# EAGLE design Radial-V Ext (EAGLE 7.4.0)
Extension Board for Radial-V.
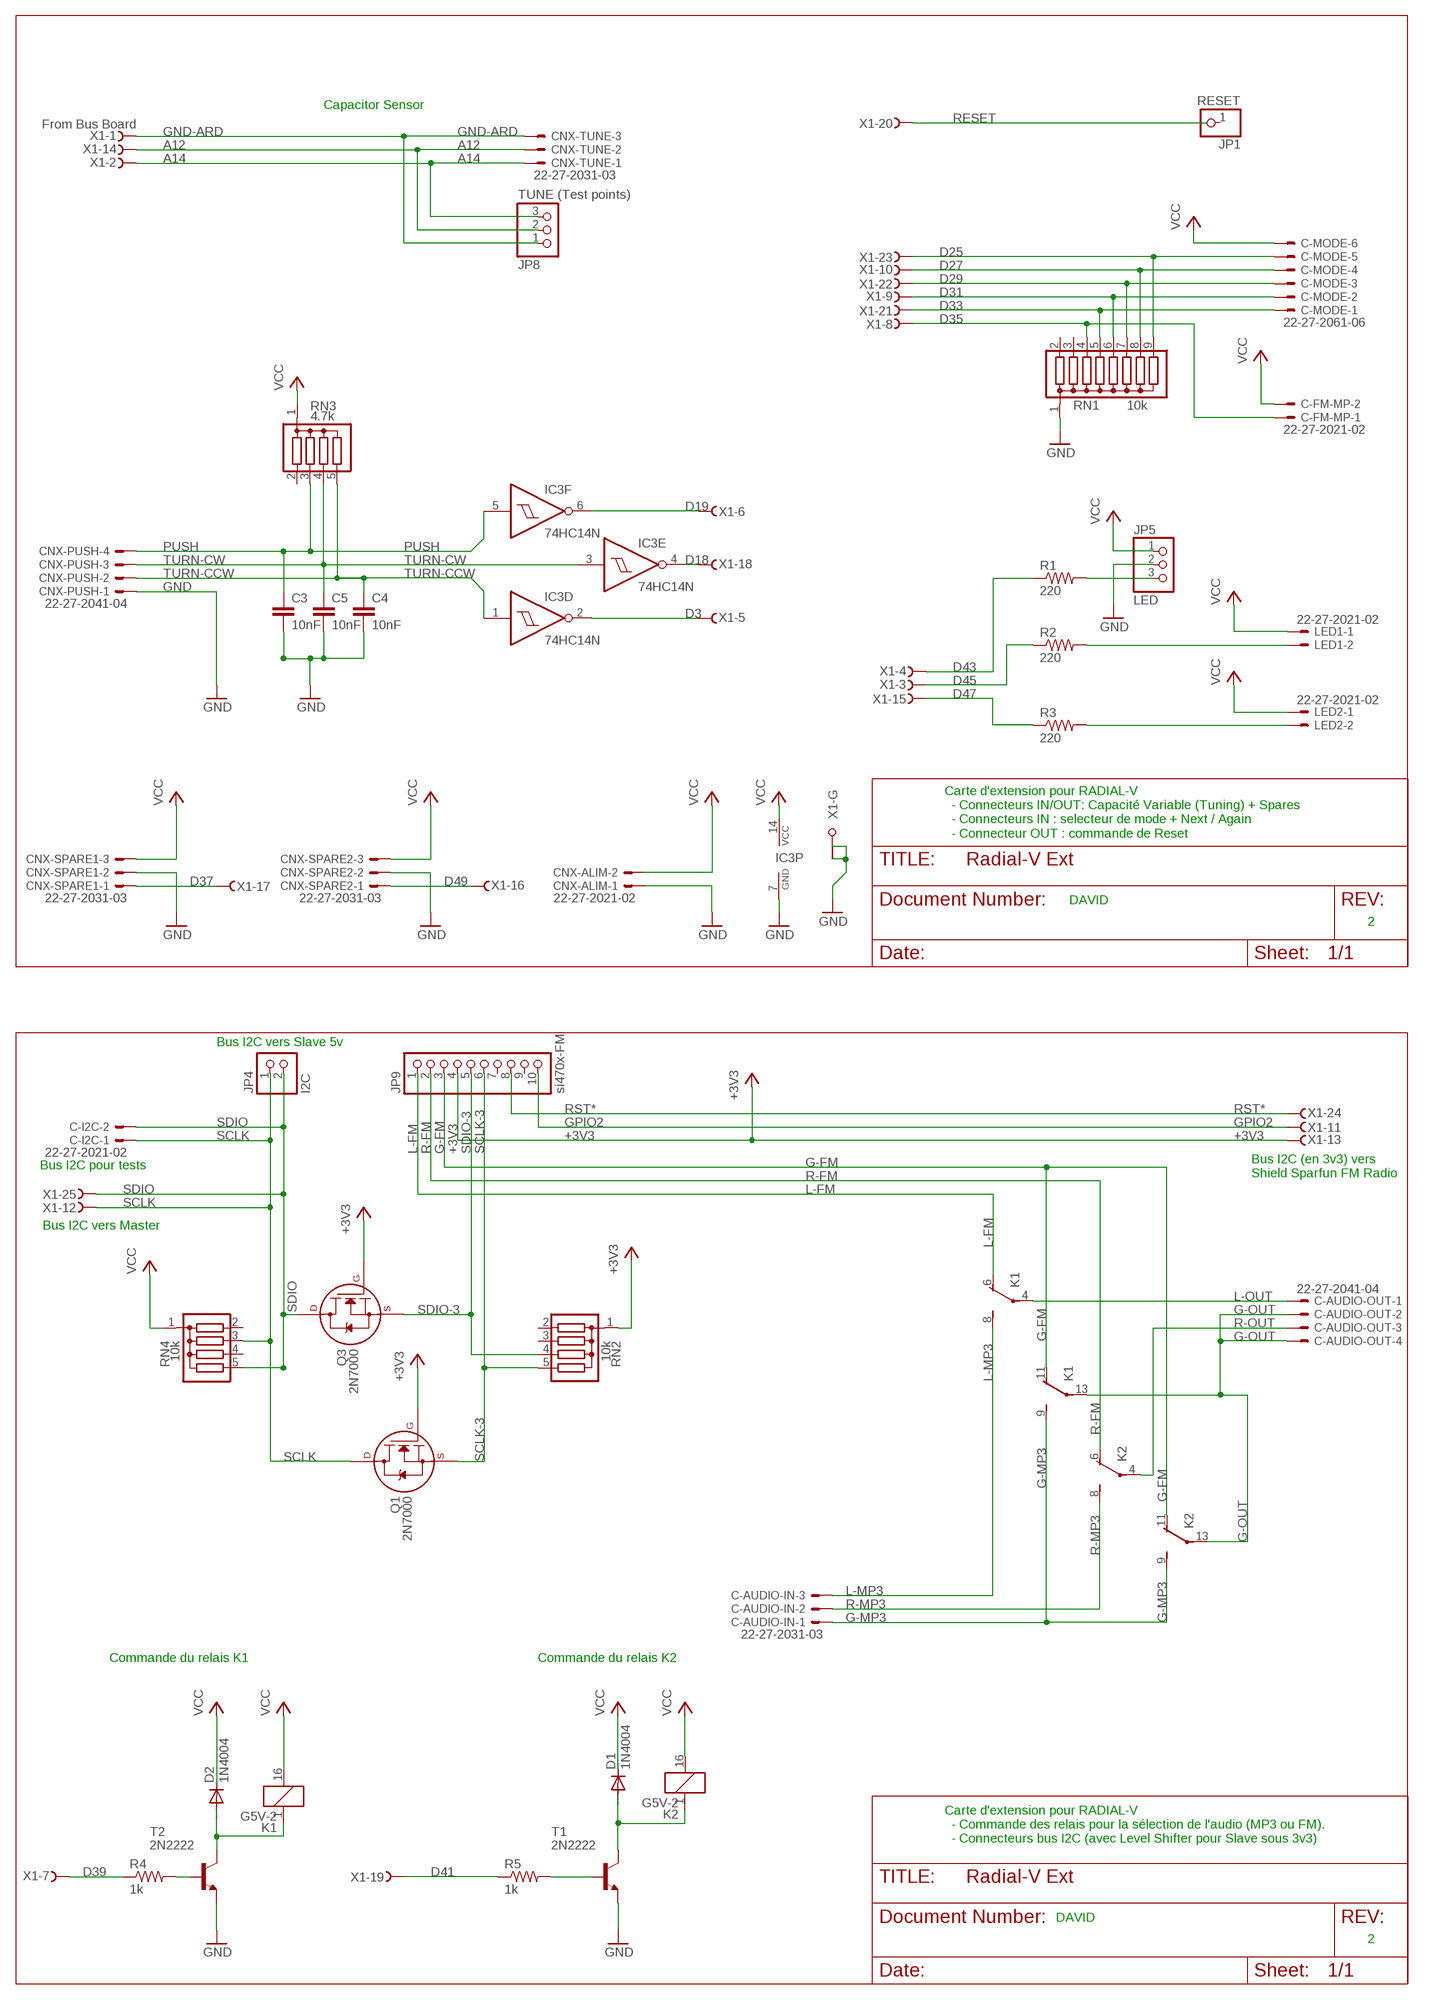
[diagram p0: schematic, sheet 1]

## Parts
C3  10nF  C-EU050-050X075  [C050-050X075]
C4  10nF  C-EU050-050X075  [C050-050X075]
C5  10nF  C-EU050-050X075  [C050-050X075]
C-AUDIO-IN  22-27-2031-03  [6410-03]
C-AUDIO-OUT  22-27-2041-04  [6410-04]
C-FM-MP  22-27-2021-02  [6410-02]
C-I2C  22-27-2021-02  [6410-02]
C-MODE  22-27-2061-06  [6410-06]
CNX-ALIM  22-27-2021-02  [6410-02]
CNX-PUSH  22-27-2041-04  [6410-04]
CNX-SPARE1  22-27-2031-03  [6410-03]
CNX-SPARE2  22-27-2031-03  [6410-03]
CNX-TUNE  22-27-2031-03  [6410-03]
D1  1N4004  [DO41-10]
D2  1N4004  [DO41-10]
IC3  74HC14N  [DIL14]
JP1  RESET  PINHD-1X1  [1X01]
JP4  I2C  PINHD-1X2  [1X02]
JP5  LED  PINHD-1X3  [1X03]
JP8  TUNE (Test points)  PINHD-1X3  [1X03]
JP9  si470x-FM  PINHD-1X10  [1X10]
K1  G5V-2  [G5V-2]
K2  G5V-2  [G5V-2]
LED1  22-27-2021-02  [6410-02]
LED2  22-27-2021-02  [6410-02]
Q1  2N7000  2N7000_TO92  [TO-92]
Q3  2N7000  2N7000_TO92  [TO-92]
R1  220  R-US_0411/15  [0411/15]
R2  220  R-US_0411/15  [0411/15]
R3  220  R-US_0411/15  [0411/15]
R4  1k  R-US_0411/15  [0411/15]
R5  1k  R-US_0411/15  [0411/15]
RN1  10k  G08R  [SIL9]
RN2  10k  G04R  [SIL5]
RN3  4.7k  G04R  [SIL5]
RN4  10k  G04R  [SIL5]
T1  2N2222  [TO18]
T2  2N2222  [TO18]
X1  From Bus Board  F25HPS  [F25HP]

## Nets
+3V3: JP9.4 Q1.2(G) Q3.2(G) RN2.1 X1.13(-13:F)
A12: CNX-TUNE.2 JP8.2 X1.14(-14:F)
A14: CNX-TUNE.1 JP8.3 X1.2(-2:F)
D3: IC3.2(D:O) X1.5(-5:F)
D18: IC3.4(E:O) X1.18(-18:F)
D19: IC3.6(F:O) X1.6(-6:F)
D25: C-MODE.5 RN1.9 X1.23(-23:F)
D27: C-MODE.4 RN1.8 X1.10(-10:F)
D29: C-MODE.3 RN1.7 X1.22(-22:F)
D31: C-MODE.2 RN1.6 X1.9(-9:F)
D33: C-MODE.1 RN1.5 X1.21(-21:F)
D35: C-FM-MP.1 RN1.4 X1.8(-8:F)
D37: CNX-SPARE1.1 X1.17(-17:F)
D39: R4.1 X1.7(-7:F)
D41: R5.1 X1.19(-19:F)
D43: R1.1 X1.4(-4:F)
D45: R2.1 X1.3(-3:F)
D47: R3.1 X1.15(-15:F)
D49: CNX-SPARE2.1 X1.16(-16:F)
G-FM: JP9.3 K1.11(2:O) K2.11(2:O)
G-MP3: C-AUDIO-IN.1 K1.9(2:S) K2.9(2:S)
G-OUT: C-AUDIO-OUT.2 C-AUDIO-OUT.4 K1.13(2:P) K2.13(2:P)
GND [power]: C3.2 C4.2 C5.2 CNX-ALIM.1 CNX-PUSH.1 CNX-SPARE1.2 CNX-SPARE2.2 IC3.7(P:GND) JP5.2 RN1.1 T1.1(E) T2.1(E) X1.G1(-G:G1) X1.G2(-G:G2)
GND-ARD: CNX-TUNE.3 JP8.1 X1.1(-1:F)
GPIO2: JP9.10 X1.11(-11:F)
L-FM: JP9.1 K1.6(1:O)
L-MP3: C-AUDIO-IN.3 K1.8(1:S)
L-OUT: C-AUDIO-OUT.1 K1.4(1:P)
N$1: D2.A K1.1 T2.3(C)
N$2: LED1.2 R2.2
N$7: D1.A K2.1 T1.3(C)
N$9: JP5.3 R1.2
N$12: LED2.2 R3.2
N$19: R4.2 T2.2(B)
N$20: R5.2 T1.2(B)
PUSH: C3.1 CNX-PUSH.4 IC3.5(F:I) RN3.3
R-FM: JP9.2 K2.6(1:O)
R-MP3: C-AUDIO-IN.2 K2.8(1:S)
R-OUT: C-AUDIO-OUT.3 K2.4(1:P)
RESET: X1.20(-20:F)
RST*: JP9.8 X1.24(-24:F)
SCLK: C-I2C.1 JP4.1 Q1.3(D) RN4.3 X1.12(-12:F)
SCLK-3: JP9.6 Q1.1(S) RN2.5
SDIO: C-I2C.2 JP4.2 Q3.3(D) RN4.5 X1.25(-25:F)
SDIO-3: JP9.5 Q3.1(S) RN2.4
TURN-CCW: C4.1 CNX-PUSH.2 IC3.1(D:I) RN3.5
TURN-CW: C5.1 CNX-PUSH.3 IC3.3(E:I) RN3.4
VCC [power]: C-FM-MP.2 C-MODE.6 CNX-ALIM.2 CNX-SPARE1.3 CNX-SPARE2.3 D1.C D2.C IC3.14(P:VCC) JP5.1 K1.16 K2.16 LED1.1 LED2.1 RN3.1 RN4.1
Unconnected: IC3.8(C:O) IC3.9(C:I) IC3.10(B:O) IC3.11(B:I) IC3.12(A:O) IC3.13(A:I) JP1.1 JP9.7 JP9.9 RN1.2 RN1.3 RN2.2 RN2.3 RN3.2 RN4.2 RN4.4

## Notes on the sheet
- Capacitor Sensor
- Carte d'extension pour RADIAL-V
    - Connecteurs IN/OUT: Capacité Variable (Tuning) + Spares
    - Connecteurs IN : selecteur de mode + Next / Again
    - Connecteur OUT : commande de Reset
- DAVID
- 2
- Bus I2C vers Slave 5v
- Bus I2C pour tests
- Bus I2C (en 3v3) vers 
  Shield Sparfun FM Radio
- Bus I2C vers Master
- Commande du relais K1 | Commande du relais K2
- Carte d'extension pour RADIAL-V
    - Commande des relais pour la sélection de l'audio (MP3 ou FM).
    - Connecteurs bus I2C (avec Level Shifter pour Slave sous 3v3)
- DAVID
- 2

## Library data of the parts
C3-C5 = rcl:C-EU: CAPACITOR, European symbol
C-AUDIO-IN CNX-SPARE1 CNX-SPARE2 = con-molex:22-?-03: CONNECTOR wire to board 2.54 mm (.1 inch) pitch header; OC_FARNELL: 2366181; OC_NEWARK: unknown
C-AUDIO-OUT CNX-PUSH = con-molex:22-?-04: CONNECTOR wire to board 2.54 mm (.1 inch) pitch header; OC_FARNELL: unknown; OC_NEWARK: unknown
C-FM-MP C-I2C CNX-ALIM LED1 LED2 = con-molex:22-?-02: CONNECTOR wire to board 2.54 mm (.1 inch) pitch header; OC_FARNELL: unknown; OC_NEWARK: unknown
C-MODE = con-molex:22-?-06: CONNECTOR wire to board 2.54 mm (.1 inch) pitch header; OC_FARNELL: unknown; OC_NEWARK: unknown
CNX-TUNE = con-molex:22-?-03: CONNECTOR wire to board 2.54 mm (.1 inch) pitch header; OC_FARNELL: unknown; OC_NEWARK: unknown
D1 D2 = diode:1N4004: DIODE general purpose rectifier, 1 A
IC3 = 74xx-eu:74*14: Hex schmitt trigger INVERTER
JP1 = pinhead:PINHD-1X1: PIN HEADER
JP4 = pinhead:PINHD-1X2: PIN HEADER
JP5 JP8 = pinhead:PINHD-1X3: PIN HEADER
JP9 = pinhead:PINHD-1X10: PIN HEADER
K1 K2 = relay:G5V-2: OMRON PCB Relay Source: http://www.omron.com/ecb/products/pdf/en-g5v2.pdf; MPN: G5V-2 5DC; OC_FARNELL: 9949488; OC_NEWARK: 78K5703
Q1 Q3 = transistors:2N700*: 2N7000, 2N7002, NDS7002A N-channel enhancement mode MOSFET
R1-R5 = rcl:R-US_: RESISTOR, American symbol
RN1 = resistor-sil:G08R: SIL RESISTOR; OC_FARNELL: unknown; OC_NEWARK: unknown
RN2-RN4 = resistor-sil:G04R: SIL RESISTOR; OC_FARNELL: unknown; OC_NEWARK: unknown
T1 T2 = transistor:2N2222: NPN TRANSISTOR
X1 = con-subd:F25HPS: SUB-D; OC_FARNELL: unknown; OC_NEWARK: unknown

## Net classes
0 default: width 0.406 mm, drill 0.787 mm, clearance 0.279 mm
1 power: width 0.813 mm, drill 0.787 mm, clearance 0.279 mm

## Board
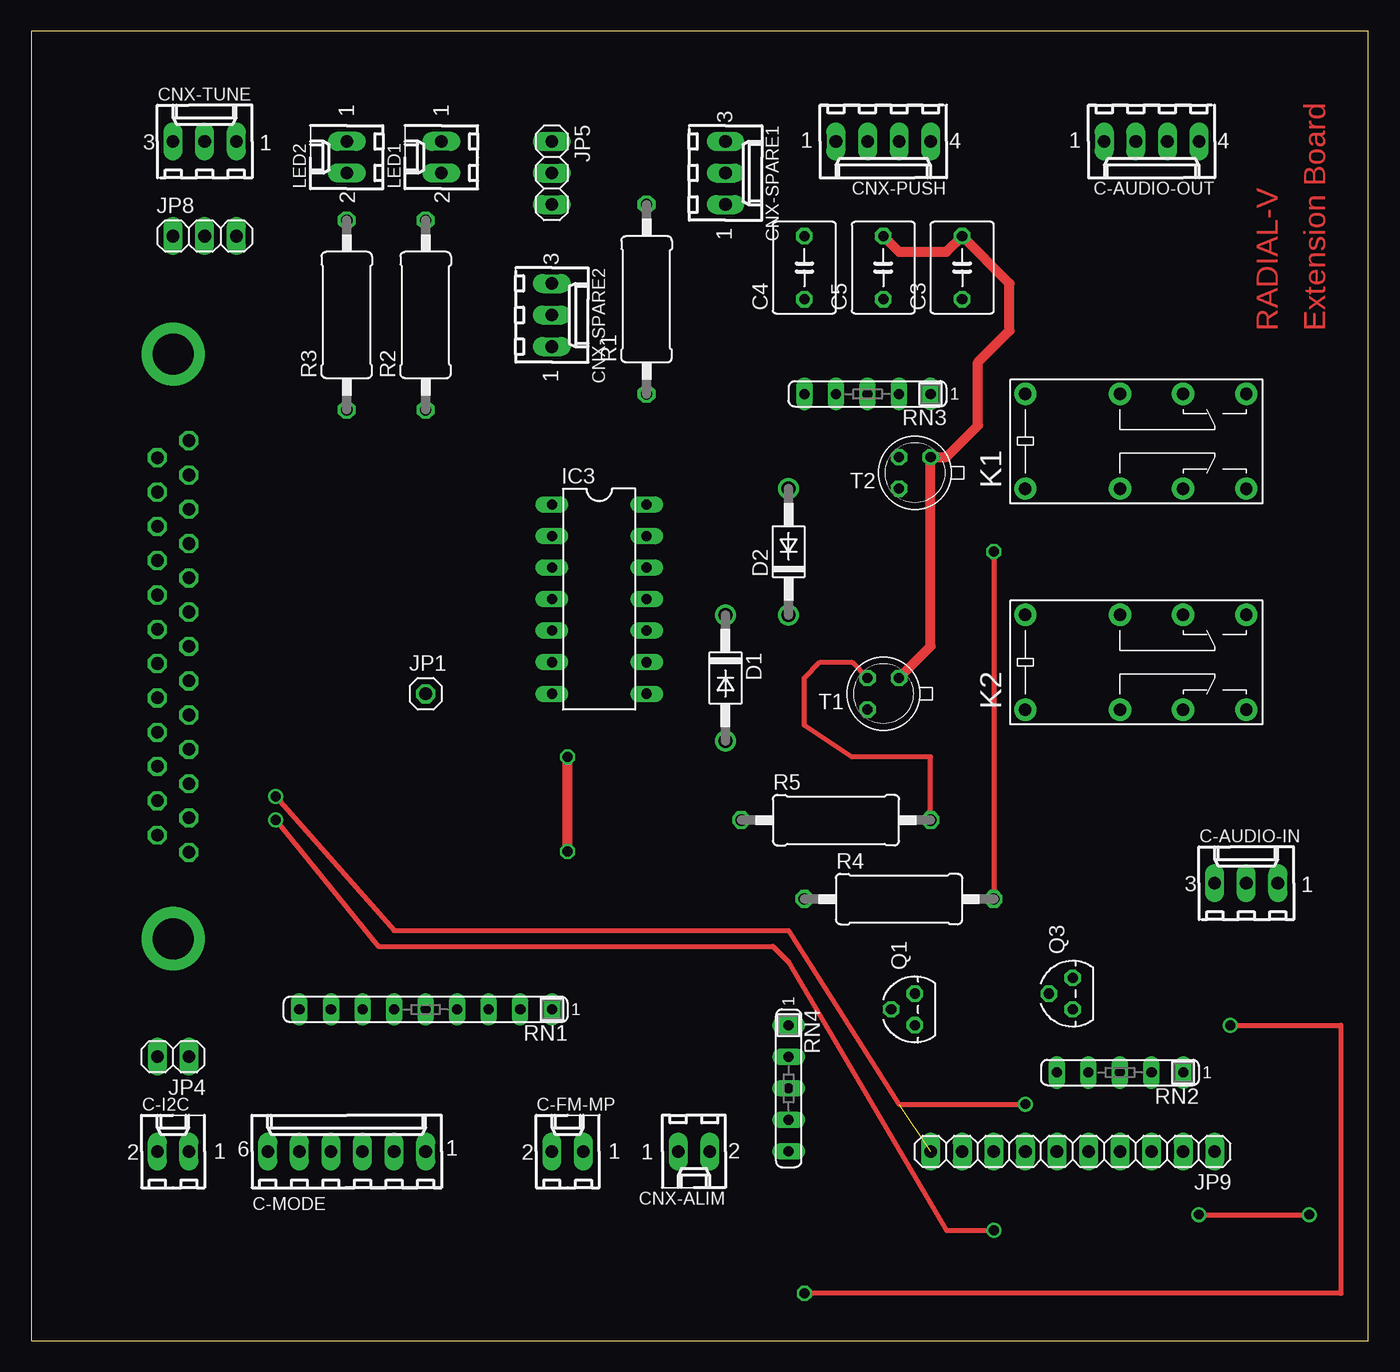
[diagram p1: board, top side]
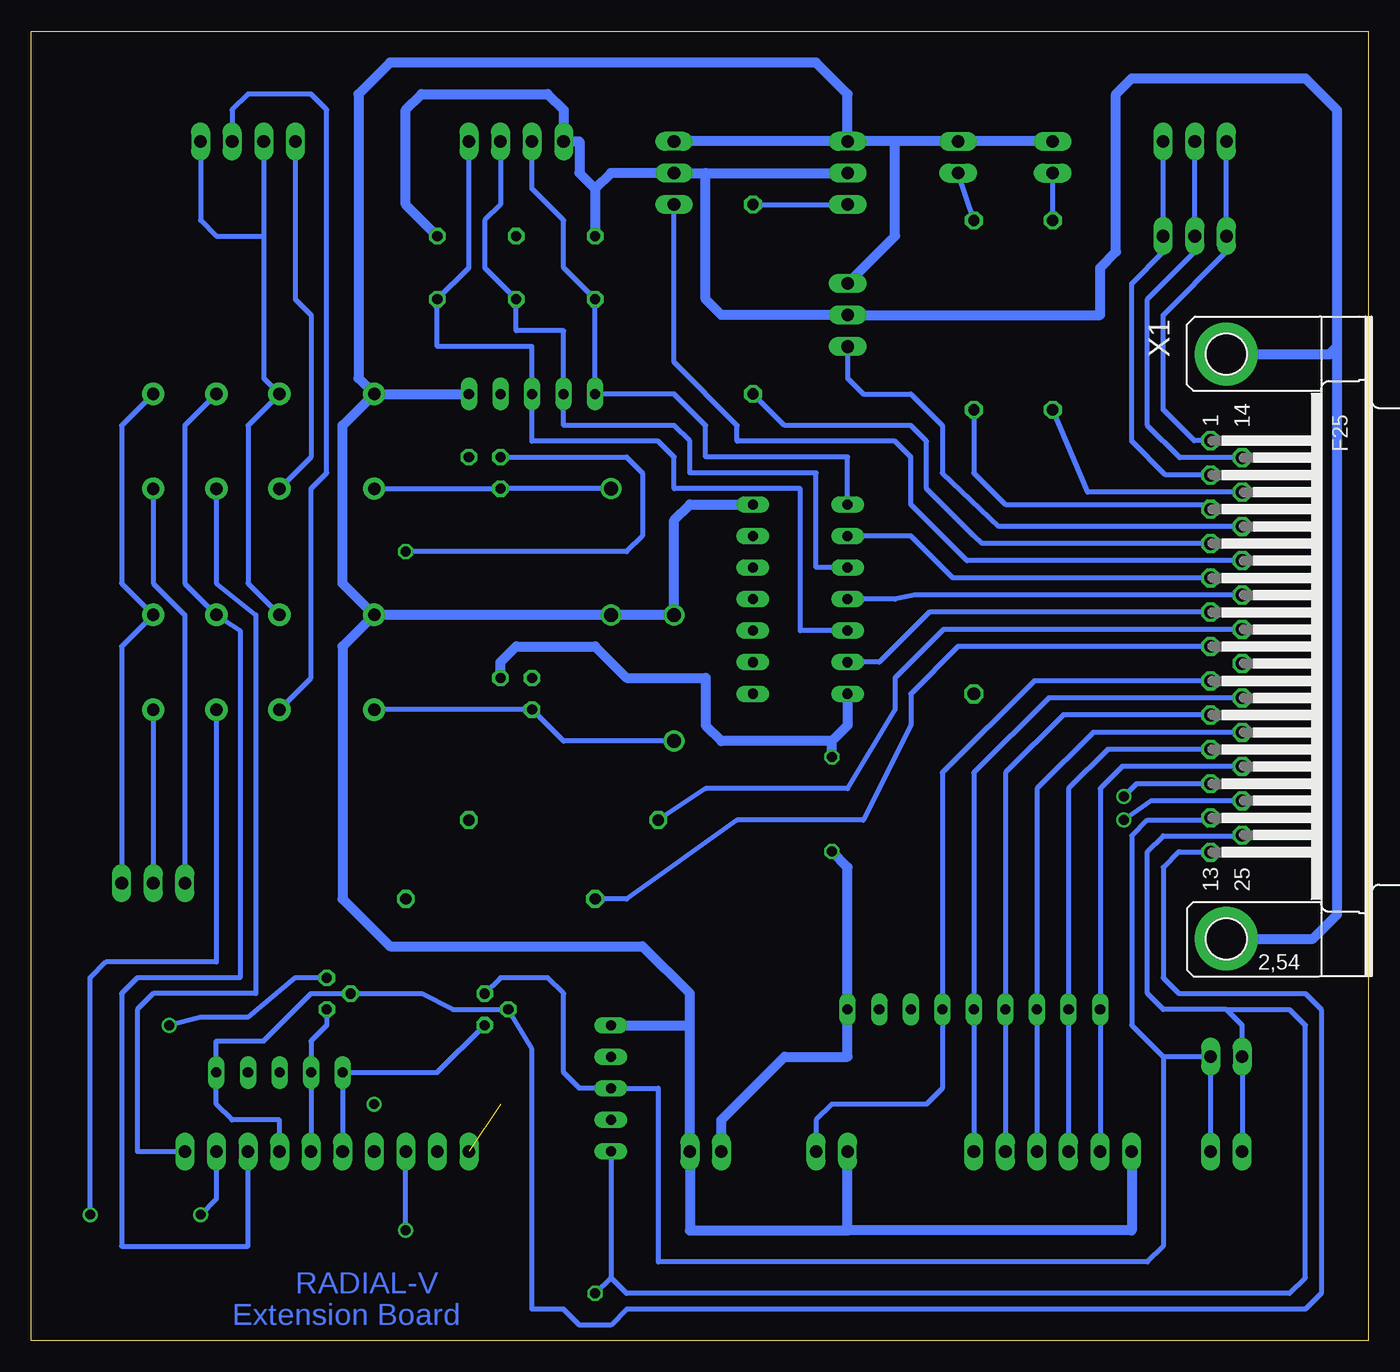
[diagram p2: board, bottom side, seen from below]

Size 107.62 x 105.4 mm. Coordinates in mm from the lower left corner, seen from the top.
Outline: 0,0 107.62,0 107.62,105.4 0,105.4 0,0
Copper layers (1*16): Top 0.035mm / dielectric 1.5mm / Bottom 0.035mm
Design rules "default": minimum track width 10mil, minimum drill 24mil, track to track 8mil, track to pad 8mil, pad to pad 8mil, via to via 8mil, smd to smd 8mil, copper to edge 40mil, drill to drill 8mil, minimum pad ring 10mil, minimum via ring 8mil, stop-mask expansion 4mil, vias tented up to drill 0mil, thermal gap 10mil

### Footprints (pad centres in the part's own frame; a part is rotated, then mirrored left to right if it is on the bottom)
C050-050X075 = drill 0.813 octagon: 1 -2.54,0; 2 2.54,0
6410-03 = drill 1.016 long: 1 2.54,0; 2 0,0; 3 -2.54,0
6410-04 = drill 1.016 long: 1 3.81,0; 2 1.27,0; 3 -1.27,0; 4 -3.81,0
6410-02 = drill 1.016 long: 1 1.27,0; 2 -1.27,0
6410-06 = drill 1.016 long: 1 6.35,0; 2 3.81,0; 3 1.27,0; 4 -1.27,0; 5 -3.81,0; 6 -6.35,0
DO41-10 = drill 1.118: A 5.08,0; C -5.08,0
DIL14 = drill 0.813 long: 1 -7.62,-3.81; 2 -5.08,-3.81; 3 -2.54,-3.81; 4 0,-3.81; 5 2.54,-3.81; 6 5.08,-3.81; 7 7.62,-3.81; 8 7.62,3.81; 9 5.08,3.81; 10 2.54,3.81; 11 0,3.81; 12 -2.54,3.81; 13 -5.08,3.81; 14 -7.62,3.81
1X01 = drill 1.016 octagon: 1 0,0
1X02 = drill 1.016 long: 1 -1.27,0; 2 1.27,0
1X03 = drill 1.016 long: 1 -2.54,0; 2 0,0; 3 2.54,0
1X10 = drill 1.016 long: 1 -11.43,0; 2 -8.89,0; 3 -6.35,0; 4 -3.81,0; 5 -1.27,0; 6 1.27,0; 7 3.81,0; 8 6.35,0; 9 8.89,0; 10 11.43,0
G5V-2 = drill 1 pad 1.8: 1 -8.89,-3.81; 4 -1.27,-3.81; 6 3.81,-3.81; 8 8.89,-3.81; 9 8.89,3.81; 11 3.81,3.81; 13 -1.27,3.81; 16 -8.89,3.81
TO-92 = drill 0.813 octagon: 1 -1.27,0; 2 0,1.905; 3 1.27,0
0411/15 = drill 0.914 octagon: 1 -7.62,0; 2 7.62,0
SIL9 = drill 0.813 long: 1 -10.16,0; 2 -7.62,0; 3 -5.08,0; 4 -2.54,0; 5 0,0; 6 2.54,0; 7 5.08,0; 8 7.62,0; 9 10.16,0
SIL5 = drill 0.813 long: 1 -5.08,0; 2 -2.54,0; 3 0,0; 4 2.54,0; 5 5.08,0
TO18 = drill 0.813 octagon: 1 -1.27,-1.27; 2 1.27,-1.27; 3 1.27,1.27
F25HP = drill 1.016 octagon: 1 -16.561,-1.27; 2 -13.792,-1.27; 3 -11.049,-1.27; 4 -8.28,-1.27; 5 -5.512,-1.27; 6 -2.769,-1.27; 7 0,-1.27; 8 2.769,-1.27; 9 5.512,-1.27; 10 8.28,-1.27; 11 11.049,-1.27; 12 13.792,-1.27; 13 16.561,-1.27; 14 -15.189,1.27; 15 -12.421,1.27; 16 -9.652,1.27; 17 -6.909,1.27; 18 -4.14,1.27; 19 -1.372,1.27; 20 1.372,1.27; 21 4.14,1.27; 22 6.909,1.27; 23 9.652,1.27; 24 12.421,1.27; 25 15.189,1.27 | drill 3.302 pad 5.08: G1 -23.52,0; G2 23.52,0

### Placement (x,y rotation side)
C3  74.93,86.36 90 top
C4  62.23,86.36 90 top
C5  68.58,86.36 90 top
C-AUDIO-IN  97.79,36.83 0 top
C-AUDIO-OUT  90.17,96.52 180 top
C-FM-MP  43.18,15.24 0 top
C-I2C  11.43,15.24 0 top
C-MODE  25.4,15.24 0 top
CNX-ALIM  53.34,15.24 180 top
CNX-PUSH  68.58,96.52 180 top
CNX-SPARE1  55.88,93.98 270 top
CNX-SPARE2  41.91,82.55 270 top
CNX-TUNE  13.97,96.52 0 top
D1  55.88,53.34 270 top
D2  60.96,63.5 90 top
IC3  45.72,59.69 270 top
JP1  31.75,52.07 0 top
JP4  11.43,22.86 180 top
JP5  41.91,93.98 270 top
JP8  13.97,88.9 0 top
JP9  83.82,15.24 180 top
K1  88.9,72.39 0 top
K2  88.9,54.61 0 top
LED1  33.02,95.25 90 top
LED2  25.4,95.25 90 top
Q1  71.12,26.67 90 top
Q3  83.82,27.94 90 top
R1  49.53,83.82 90 top
R2  31.75,82.55 90 top
R3  25.4,82.55 90 top
R4  69.85,35.56 0 top
R5  64.77,41.91 0 top
RN1  31.75,26.67 180 top
RN2  87.63,21.59 180 top
RN3  67.31,76.2 180 top
RN4  60.96,20.32 270 top
T1  68.58,52.07 180 top
T2  71.12,69.85 180 top
X1  11.43,55.88 270 bottom

### Tracks (layer width: path | path; a pad name or v marks a point on that pad's centre or on a via)
+3V3
  Bottom 0.406: JP9.4 87.63,17.78 91.44,17.78 92.71,19.05 RN2.1 92.71,24.13 88.9,24.13 85.09,27.94 Q3.2 76.2,27.94 73.66,26.67 Q1.2 67.31,23.5 67.31,2.54 64.77,2.54 63.5,1.27 60.96,1.27 59.69,2.54 5.08,2.54 3.81,3.81 3.81,26.67 5.08,27.94 15.24,27.94 16.51,29.21 16.51,38.1 15.24,39.37 15.19,39.32 X1.13
A12
  Bottom 0.406: CNX-TUNE.2 JP8.2 13.97,87.63 17.78,83.82 17.78,73.66 15.19,71.07 X1.14
A14
  Bottom 0.406: CNX-TUNE.1 JP8.3 16.51,87.63 19.05,85.09 19.05,72.39 16.33,69.67 X1.2
D3
  Bottom 0.406: X1.5 33.45,61.39 36.83,64.77 IC3.2
D18
  Bottom 0.406: X1.18 36.5,60.02 38.1,59.69 IC3.4
D19
  Bottom 0.406: X1.6 35.33,58.65 39.37,54.61 IC3.6
D25
  Bottom 0.406: X1.23 19.81,46.23 21.59,44.45 RN1.9 C-MODE.5
D27
  Bottom 0.406: X1.10 20.98,47.6 24.13,44.45 RN1.8 C-MODE.4
D29
  Bottom 0.406: X1.22 22.15,48.97 26.67,44.45 RN1.7 C-MODE.3
D31
  Bottom 0.406: C-MODE.2 RN1.6 29.21,45.72 24.56,50.37 X1.9
D33
  Bottom 0.406: C-MODE.1 RN1.5 31.75,45.72 25.73,51.74 X1.21
D35
  Bottom 0.406: C-FM-MP.1 44.45,17.78 43.18,19.05 35.56,19.05 34.29,20.32 RN1.4 34.29,45.72 26.9,53.11 X1.8
D37
  Bottom 0.406: CNX-SPARE1.1 55.88,78.74 50.8,73.66 50.8,72.39 38.1,72.39 36.83,71.12 36.83,67.31 32.31,62.79 X1.17
D39
  Bottom 0.406: X1.7 33.02,55.88 36.83,52.07 36.83,49.53 40.64,41.91 50.8,41.91 59.69,35.56 R4.1
D41
  Bottom 0.406: X1.19 34.19,57.25 38.1,53.34 38.1,50.8 41.91,44.45 53.34,44.45 R5.1
D43
  Bottom 0.406: X1.4 31.09,64.16 31.75,64.77 35.56,68.58 35.56,72.39 36.83,73.66 46.99,73.66 R1.1
D45
  Bottom 0.406: R2.1 31.75,69.85 29.21,67.31 13.08,67.31 X1.3
D47
  Bottom 0.406: X1.15 22.58,68.3 R3.1
D49
  Bottom 0.406: CNX-SPARE2.1 41.91,77.47 40.64,76.2 36.83,76.2 34.29,73.66 34.29,69.85 29.72,65.53 X1.16
G-FM
  Bottom 0.406: K1.11 95.25,73.66 95.25,60.96 K2.11 90.81,57.15 90.81,29.21 99.06,29.21 100.33,27.94 100.33,7.62 90.17,7.62 JP9.3
G-MP3
  Bottom 0.406: K1.9 100.33,73.66 100.33,60.96 K2.9 100.33,55.88 C-AUDIO-IN.1
G-OUT
  Bottom 0.406: K2.13 90.17,60.96 90.17,73.66 K1.13 88.9,77.47 88.9,88.9 | C-AUDIO-OUT.2 88.9,88.9 | C-AUDIO-OUT.4 93.98,90.17 92.71,88.9 88.9,88.9
GND  (via drill 0.8 pad 0.81)
  Top 0.813: T1.1 72.39,55.88 T2.1 73.66,71.12 76.2,73.66 76.2,78.74 78.74,81.28 78.74,85.09 C3.2 73.66,87.63 69.85,87.63 C5.2 | v43.18,39.37 v43.18,46.99
  Bottom 0.813: 53.34,93.98 CNX-SPARE1.2 60.96,93.98 62.23,92.71 | 53.34,93.98 JP5.2 | 62.23,92.71 63.5,93.98 63.5,96.52 CNX-PUSH.1 64.77,99.06 66.04,100.33 76.2,100.33 77.47,99.06 77.47,91.44 C3.2 | 62.23,92.71 C4.2 | 53.34,93.98 53.34,83.82 52.07,82.55 CNX-SPARE2.2 21.59,82.55 21.59,86.36 20.32,87.63 20.32,100.33 19.05,101.6 5.08,101.6 2.54,99.06 2.54,80.01 | T1.1 69.85,54.61 68.58,55.88 62.23,55.88 59.69,53.34 53.34,53.34 53.34,49.53 52.07,48.26 43.18,48.26 | CNX-ALIM.1 52.07,17.78 46.99,22.86 41.91,22.86 RN1.1 41.91,38.1 v43.18,39.37 | IC3.7 41.91,49.53 43.18,48.26 | v43.18,46.99 43.18,48.26 | 2.54,80.01 2.54,34.29 4.47,32.36 X1.G2 | X1.G1 3.15,79.4 2.54,80.01
GND-ARD
  Bottom 0.406: CNX-TUNE.3 JP8.1 11.43,87.63 16.51,82.55 16.51,74.93 14.02,72.44 X1.1
GPIO2  (via drill 0.8)  (1 unrouted)
  Top 0.406: v19.68,43.81 29.21,33.02 60.96,33.02 69.85,19.05 v80.01,19.05
  Bottom 0.406: X1.11 18.67,44.83 v19.68,43.81
L-FM
  Bottom 0.406: K1.6 92.71,60.96 89.53,58.42 89.53,27.94 97.79,27.94 99.06,26.67 99.06,15.24 JP9.1
L-MP3
  Bottom 0.406: K1.8 97.79,60.96 95.25,58.42 C-AUDIO-IN.3
L-OUT
  Bottom 0.406: C-AUDIO-OUT.1 86.36,83.82 85.09,82.55 85.09,71.12 K1.4
N$1
  Bottom 0.406: D2.A T2.3 K1.1
N$2
  Bottom 0.406: R2.2 LED1.2
N$7
  Bottom 0.406: D1.A 64.77,48.26 T1.3 K2.1
N$9
  Bottom 0.406: R1.2 JP5.3
N$12
  Bottom 0.406: R3.2 LED2.2
N$19  (via drill 0.8 pad 0.81)
  Top 0.406: v77.47,63.5 R4.2
  Bottom 0.406: T2.2 59.69,71.12 58.42,69.85 58.42,64.77 59.69,63.5 v77.47,63.5
N$20
  Top 0.406: R5.2 72.39,46.99 66.04,46.99 62.23,49.53 62.23,53.34 63.5,54.61 66.04,54.61 T1.2
PUSH
  Bottom 0.406: IC3.5 45.72,57.15 45.72,68.58 55.88,68.58 55.88,71.12 57.15,72.39 67.31,72.39 RN3.3 67.31,80.01 74.93,80.01 C3.1 72.39,86.36 CNX-PUSH.4
R-FM  (via drill 0.8 pad 0.81)
  Top 0.406: v93.98,10.16 v102.87,10.16
  Bottom 0.406: K2.6 92.71,30.48 101.6,30.48 102.87,29.21 v102.87,10.16 | JP9.2 92.71,11.43 v93.98,10.16
R-MP3
  Bottom 0.406: K2.8 C-AUDIO-IN.2
R-OUT
  Bottom 0.406: K2.4 85.09,53.34 85.09,68.58 83.82,69.85 83.82,99.06 85.09,100.33 90.17,100.33 91.44,99.06 C-AUDIO-OUT.3
RST*  (via drill 0.8)
  Top 0.406: v19.68,41.91 27.94,31.75 59.69,31.75 60.96,30.48 73.66,8.89 v77.47,8.89
  Bottom 0.406: v77.47,8.89 JP9.8 | X1.24 17.5,43.46 v19.68,41.91
SCLK
  Bottom 0.406: C-I2C.1 JP4.1 16.51,22.86 | X1.12 12.88,41.91 17.78,41.91 19.05,40.64 19.05,25.4 16.51,22.86 | 16.51,22.86 16.51,7.62 17.78,6.35 57.15,6.35 57.15,20.32 RN4.3 63.5,20.32 64.77,21.59 64.77,27.94 66.04,29.21 69.85,29.21 Q1.3
SCLK-3
  Bottom 0.406: JP9.6 RN2.5 74.93,21.59 Q1.1
SDIO  (via drill 0.8 pad 0.81)
  Top 0.406: v96.52,25.4 105.41,25.4 105.41,3.81 v62.23,3.81
  Bottom 0.406: C-I2C.2 JP4.2 10.16,25.4 11.43,26.67 | 11.43,26.67 16.51,26.67 17.78,27.94 17.78,39.37 16.51,40.64 10.21,40.64 X1.25 | 11.43,26.67 6.35,26.67 5.08,25.4 5.08,5.08 6.35,3.81 59.69,3.81 60.96,5.08 | RN4.5 60.96,5.08 | Q3.3 86.36,29.21 90.17,26.04 93.98,26.04 v96.52,25.4 | v62.23,3.81 60.96,5.08
SDIO-3
  Bottom 0.406: JP9.5 RN2.4 85.09,24.13 83.82,25.4 Q3.1
TURN-CCW
  Bottom 0.406: IC3.1 41.91,71.12 53.34,71.12 53.34,73.66 55.88,76.2 RN3.5 C4.1 64.77,86.36 64.77,90.17 67.31,92.71 CNX-PUSH.2
TURN-CW
  Bottom 0.406: IC3.3 44.45,62.23 44.45,69.85 54.61,69.85 54.61,72.39 55.88,73.66 64.77,73.66 RN3.4 64.77,81.28 68.58,81.28 C5.1 71.12,86.36 71.12,90.17 69.85,91.44 CNX-PUSH.3
VCC
  Bottom 0.813: LED2.1 LED1.1 38.1,96.52 | 38.1,96.52 JP5.1 | JP5.1 CNX-SPARE1.3 | 41.91,8.89 54.61,8.89 CNX-ALIM.2 54.61,25.4 | 41.91,8.89 C-FM-MP.2 | C-MODE.6 19.05,8.89 41.91,8.89 | K2.16 D2.C D1.C | K1.16 RN3.1 | D1.C 55.88,66.04 54.61,67.31 IC3.14 | K2.16 82.55,60.96 82.55,73.66 K1.16 | JP5.1 41.91,100.33 44.45,102.87 78.74,102.87 81.28,100.33 81.28,77.47 K1.16 | CNX-SPARE2.3 38.1,88.9 38.1,96.52 | 54.61,25.4 54.61,27.94 58.42,31.75 78.74,31.75 82.55,35.56 82.55,55.88 K2.16 | D1.C K2.16 | RN4.1 54.61,25.4

### Text on the board
Top: RADIAL-V | Extension Board
Bottom: RADIAL-V | Extension Board